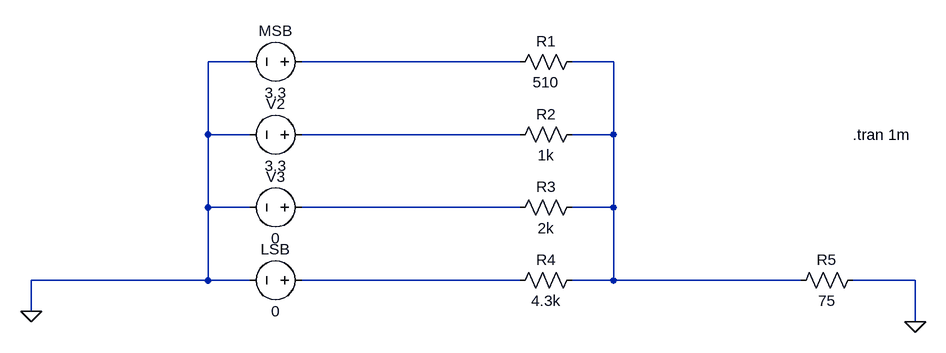
[diagram p0: schematic ResistorDAC.asc]
ResistorDAC.asc, the LTspice schematic file:
Version 4.1
SHEET 1 880 680
WIRE -448 -112 -512 -112
WIRE -32 -112 -368 -112
WIRE 112 -112 48 -112
WIRE -512 0 -512 -112
WIRE -448 0 -512 0
WIRE -32 0 -368 0
WIRE 112 0 112 -112
WIRE 112 0 48 0
WIRE -512 112 -512 0
WIRE -448 112 -512 112
WIRE -32 112 -368 112
WIRE 112 112 112 0
WIRE 112 112 48 112
WIRE -512 224 -512 112
WIRE -512 224 -784 224
WIRE -448 224 -512 224
WIRE -32 224 -368 224
WIRE 112 224 112 112
WIRE 112 224 48 224
WIRE 400 224 112 224
WIRE 576 224 480 224
WIRE -784 272 -784 224
WIRE 576 288 576 224
FLAG -784 272 0
FLAG 576 288 0
SYMBOL res 64 -128 R90
WINDOW 0 0 56 VBottom 2
WINDOW 3 32 56 VTop 2
SYMATTR InstName R1
SYMATTR Value 510
SYMBOL res 64 -16 R90
WINDOW 0 0 56 VBottom 2
WINDOW 3 32 56 VTop 2
SYMATTR InstName R2
SYMATTR Value 1k
SYMBOL res 64 96 R90
WINDOW 0 0 56 VBottom 2
WINDOW 3 32 56 VTop 2
SYMATTR InstName R3
SYMATTR Value 2k
SYMBOL res 64 208 R90
WINDOW 0 0 56 VBottom 2
WINDOW 3 32 56 VTop 2
SYMATTR InstName R4
SYMATTR Value 4.3k
SYMBOL voltage -352 -112 R90
WINDOW 0 -32 56 VBottom 2
WINDOW 3 32 56 VTop 2
WINDOW 123 0 0 Left 0
WINDOW 39 0 0 Left 0
SYMATTR InstName MSB
SYMATTR Value 3.3
SYMBOL voltage -352 0 R90
WINDOW 0 -32 56 VBottom 2
WINDOW 3 32 56 VTop 2
SYMATTR InstName V2
SYMATTR Value 3.3
SYMBOL voltage -352 112 R90
WINDOW 0 -32 56 VBottom 2
WINDOW 3 32 56 VTop 2
SYMATTR InstName V3
SYMATTR Value 0
SYMBOL voltage -352 224 R90
WINDOW 0 -32 56 VBottom 2
WINDOW 3 32 56 VTop 2
SYMATTR InstName LSB
SYMATTR Value 0
SYMBOL res 496 208 R90
WINDOW 0 0 56 VBottom 2
WINDOW 3 32 56 VTop 2
SYMATTR InstName R5
SYMATTR Value 75
TEXT 480 0 Left 2 !.tran 1m

The netlist it stands for:
* ResistorDAC.asc
R1 N002 N001 510
R2 N002 N003 1k
R3 N002 N004 2k
R4 N002 N005 4.3k
V§MSB N001 0 3.3
V2 N003 0 3.3
V3 N004 0 0
V§LSB N005 0 0
R5 0 N002 75
.tran 1m
.backanno
.end